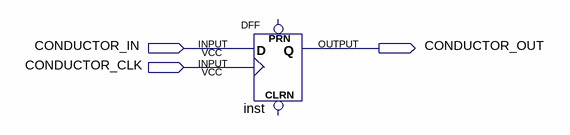
[diagram p0: schematic sheet]
// Quartus schematic CONDUCTOR.bdf as structural Verilog: 1 symbols, 3 pins
module CONDUCTOR (
  input  CONDUCTOR_IN,
  input  CONDUCTOR_CLK,
  output CONDUCTOR_OUT
);

  DFF inst (.CLK(CONDUCTOR_CLK), .D(CONDUCTOR_IN), .Q(CONDUCTOR_OUT));  // open: CLRN, PRN
endmodule
